# Altium schematic sheet main.SchDoc
size A4
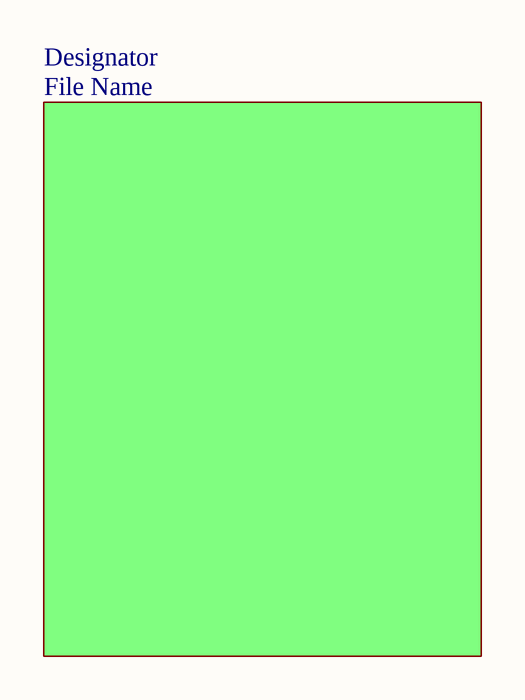
[diagram p0: main.SchDoc]

## Sub-sheets
Designator = File Name: no entries